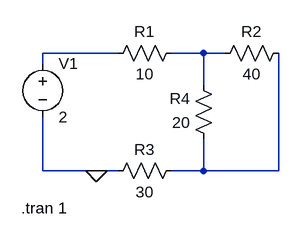
[diagram p0: schematic EXPT !A.asc]
EXPT !A.asc, the LTspice schematic file:
Version 4
SHEET 1 880 680
WIRE 16 64 -96 64
WIRE 144 64 96 64
WIRE 176 64 144 64
WIRE -96 80 -96 64
WIRE 144 112 144 64
WIRE -96 240 -96 160
WIRE -16 240 -96 240
WIRE 16 240 -16 240
WIRE 144 240 144 192
WIRE 144 240 96 240
WIRE 256 240 256 64
WIRE 256 240 144 240
FLAG -16 240 0
SYMBOL voltage -96 64 R0
SYMATTR InstName V1
SYMATTR Value 2
SYMBOL res 112 48 R90
WINDOW 0 0 56 VBottom 2
WINDOW 3 32 56 VTop 2
SYMATTR InstName R1
SYMATTR Value 10
SYMBOL res 272 48 R90
WINDOW 0 0 56 VBottom 2
WINDOW 3 32 56 VTop 2
SYMATTR InstName R2
SYMATTR Value 40
SYMBOL res 112 224 R90
WINDOW 0 0 56 VBottom 2
WINDOW 3 32 56 VTop 2
SYMATTR InstName R3
SYMATTR Value 30
SYMBOL res 160 208 R180
WINDOW 0 36 76 Left 2
WINDOW 3 36 40 Left 2
SYMATTR InstName R4
SYMATTR Value 20
TEXT -128 296 Left 2 !.tran 1

The netlist it stands for:
* EXPT !A.asc
V1 N001 0 2
R1 N002 N001 10
R2 N003 N002 40
R3 N003 0 30
R4 N003 N002 20
.tran 1
.backanno
.end